# Altium schematic sheet VREG RT9166-28PVL.SchDoc
size 90 x 54 mm
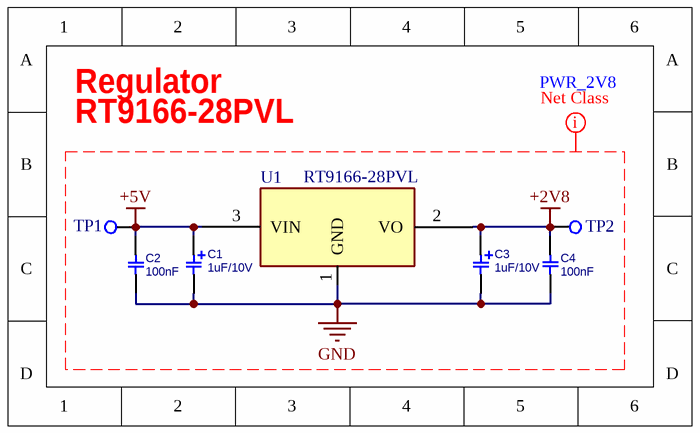
[diagram p0: VREG RT9166-28PVL.SchDoc]

## Parts
C1  1uF/10V  [C_TN_A]
C2  100nF  [C0603S]
C3  1uF/10V  [C_TN_A]
C4  100nF  [C0603S]
TP1  Test Point  [TPSMD_C1]  (value not drawn)
TP2  Test Point  [TPSMD_C1]  (value not drawn)
U1  RT9166-28PVL  [SOT23_3]

## Nets
+2V8: C3.1 C4.1 TP2.1(TP) U1.2(VO)
+5V: C1.1 C2.1 TP1.1(TP) U1.3(VIN)
GND: C1.2 C2.2 C3.2 C4.2 U1.1(GND)

## Layout directives
net class PWR_2V8: +2V8, +5V, GND

## Notes on the sheet
- RT9166-28PVL
- Regulator
- PWR_2V8

## Library data of the parts
C1 C3 = CAP_SMD_TAN: CAP, SMD, TAN; PARAM: 10V; VALUE: 1uF/10V
C2 C4 = CAP_SMD_MLCC: CAP, SMD, MLCC; PARAM: 50V; DESC: CAP, MLCC, 1nF, 50V, C0G, 10%, 0402; MANF_P#: MANF_PART#; MANF: Murata; PARAM2: C0G, 10%; PRICE: 100= 1$; ASSEMBLY: ASSEMBLY; VALUE: 100nF
U1 = VREG_RT9166A-28PVL_SOT23: REG, Linear, Fixed, 2.8v, 0.3A/0.6A, SOT23; MANF: TI; PARAM: 2.8V, 0.3mA/06mA; MANF_P#: RT9166-28PVL; PARAM2: 2.8V; VALUE: RT9166-28PVL